# Altium schematic sheet dev module.SchDoc
size A; SheetNumber: 1; SheetTotal: 3
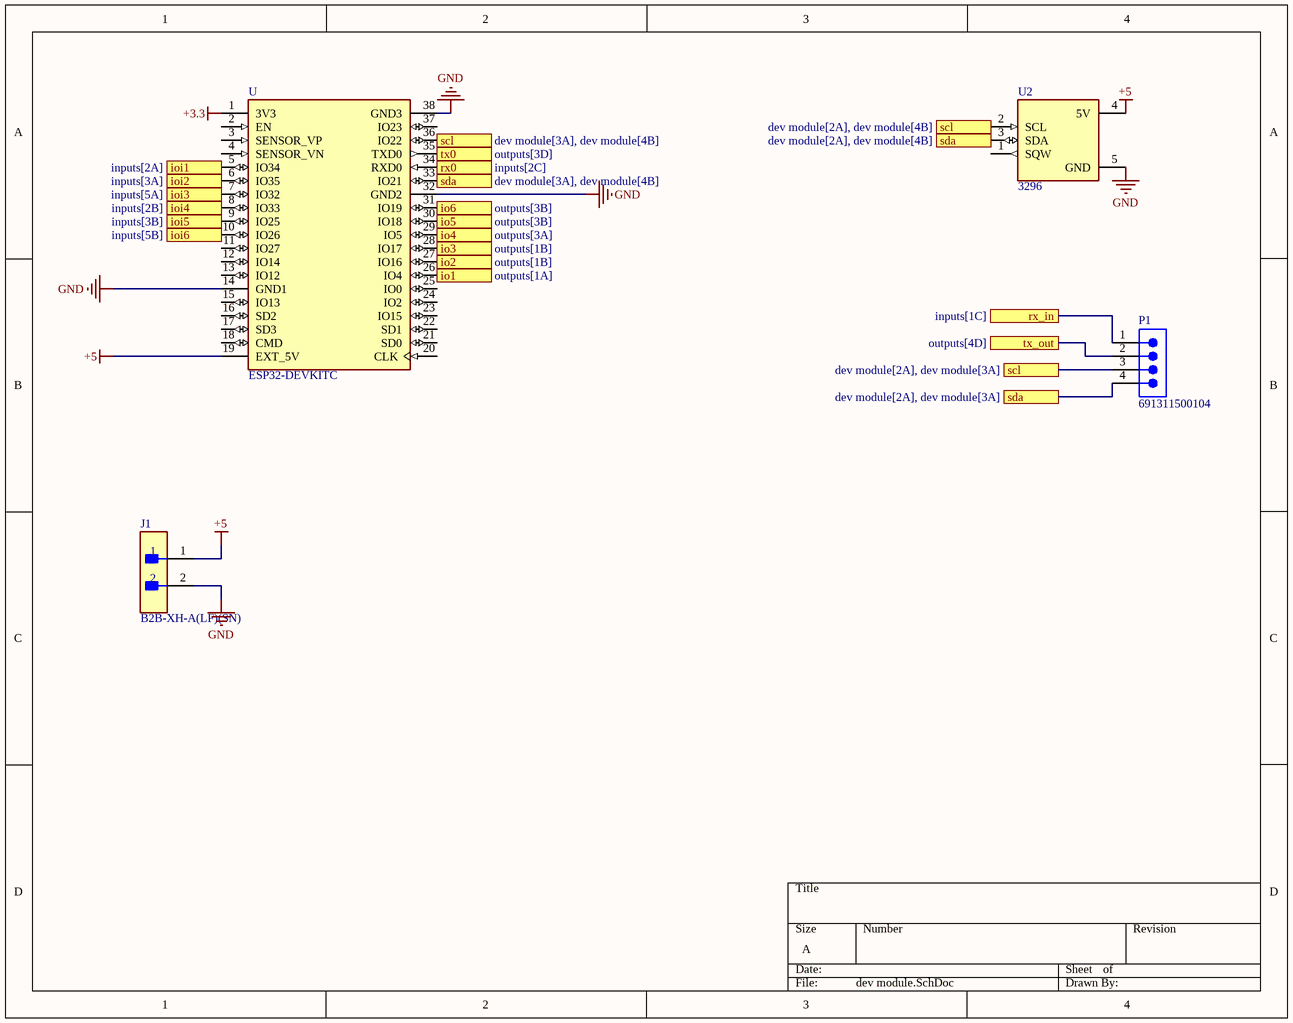
[diagram p0: dev module.SchDoc]

## Parts
J1  B2B-XH-A(LF)(SN)  [FP-B2B-XH-A_LF_SN-MFG]
P1  691311500104  [691311500104]
U  ESP32-DEVKITC  [MODULE_ESP32-DEVKITC]
U2  3296  [MODULE_3296]

## Ports
io1 (see outputs[1A]), io2 (see outputs[1B]), io3 (see outputs[1B]), io4 (see outputs[3A]), io5 (see outputs[3B]), io6 (see outputs[3B]), ioi1 (see inputs[2A]), ioi2 (see inputs[3A]), ioi3 (see inputs[5A]), ioi4 (see inputs[2B]), ioi5 (see inputs[3B]), ioi6 (see inputs[5B]), rx0 (see inputs[2C]), rx_in (see inputs[1C]), scl (see dev module[2A], dev module[3A]), scl (see dev module[2A], dev module[4B]), scl (see dev module[3A], dev module[4B]), sda (see dev module[2A], dev module[3A]), sda (see dev module[2A], dev module[4B]), sda (see dev module[3A], dev module[4B]), tx0 (see outputs[3D]), tx_out (see outputs[4D])

## Nets
+3.3: U.1(3V3)
+5: J1.1 U.19(EXT_5V) U2.4(5V)
GND: J1.2 U.14(GND1) U.32(GND2) U.38(GND3) U2.5(GND)
io1: U.26(IO4) ; port io1
io2: U.27(IO16) ; port io2
io3: U.28(IO17) ; port io3
io4: U.29(IO5) ; port io4
io5: U.30(IO18) ; port io5
io6: U.31(IO19) ; port io6
ioi1: U.5(IO34) ; port ioi1
ioi2: U.6(IO35) ; port ioi2
ioi3: U.7(IO32) ; port ioi3
ioi4: U.8(IO33) ; port ioi4
ioi5: U.9(IO25) ; port ioi5
ioi6: U.10(IO26) ; port ioi6
rx0: U.34(RXD0) ; port rx0
rx_in: P1.1 ; port rx_in
scl: P1.3 U.36(IO22) U2.2(SCL) ; port scl
sda: P1.4 U.33(IO21) U2.3(SDA) ; port sda
tx0: U.35(TXD0) ; port tx0
tx_out: P1.2 ; port tx_out

Not connected (* = marked no-connect by the designer): U 2(EN) 3(SENSOR_VP) 4(SENSOR_VN) 11(IO27) 12(IO14) 13(IO12) 15(IO13) 16(SD2) 17(SD3) 18(CMD) 20(CLK) 21(SD0) 22(SD1) 23(IO15) 24(IO2) 25(IO0) 37(IO23); U2 1(SQW)

## Library data of the parts
J1 = CMP-2000-05888-3: CONN HEADER VERT 2POS 2.5MM; Current Rating: 3A; Voltage Rating: 250V; Number of Contacts: 2; Contact Resistance: 20mR; Wire/Cable Gauge: 22AWG; Insulation Resistance: 1GR; Connector Type: Male Pin; Packaging: Bulk; Contact Material: Brass; Lead Free: Lead Free; Orientation: Straight; Contact Plating: Tin; Max Current Rating: 3A; Termination: Solder; Fastening Type: Detent; Depth: 5.75mm; Housing Material: Polyamide; REACH SVHC: No SVHC; Series: XH; Voltage Rating (AC): 250V; Number of Positions: 2; Color: Natural; Contact Type: Male Pin; Max Voltage Rating (DC): 250V; Pitch: 2.5mm; Lead Pitch: 2.5mm; Mount: Through Hole; Max Operating Temperature: 85°C; Length: 7.4mm; Max Voltage Rating (AC): 250V; Min Operating Temperature: -25°C; Number of Rows: 1; Housing Color: White
P1 = CMP-1502-02148-2: NexarPartId: 8917749; Pitch: 5.08mm; Number of Positions Per Level: 4; Gender: Male; Voltage: 300V; Current: 20A; Number of Levels: 1; Orientation: Vertical; Number of Pins: 4; Mount: Through Hole; Number of Contacts: 4; Length: 8.5mm; Number of Rows: 1; Contact Plating: Tin; Color: Green; Termination: Solder; Contact Material: Brass; REACH SVHC: Unknown; RoHS: Compliant; Lead Pitch: 5.08mm; Width: 22.32mm; Height: 12mm; Packaging: Box
U = ESP32-DEVKITC: - Transceiver; 802.11 b/g/n _Wi-Fi, WiFi, WLAN_, BluetoothÂ® Smart Ready 4.x Dual Mode For Use With ESP-WROOM-32; MP: ESP32-DEVKITC-32D-F; MF: Espressif Systems; Price: None; SnapEDA_Link: https://www.snapeda.com/parts/ESP32-DEVKITC-32D-F/Espressif%20Systems/view-part/4220172/?ref=snap; Availability: Unavailable; Value: *; Package: None
U2 = 3296: DS1307 Real Time Clock (RTC) Timing Evaluation Board; MF: Adafruit; Package: None; Price: None; Check_prices: https://www.snapeda.com/parts/3296/Adafruit+Industries/view-part/?ref=eda; Value: *; SnapEDA_Link: https://www.snapeda.com/parts/3296/Adafruit+Industries/view-part/?ref=snap; MP: 3296; Availability: In Stock; Purchase-URL: https://pricing.snapeda.com/search/part/3296/?ref=eda